# Altium schematic sheet 31 Pwr In.SchDoc
size 420 x 297 mm
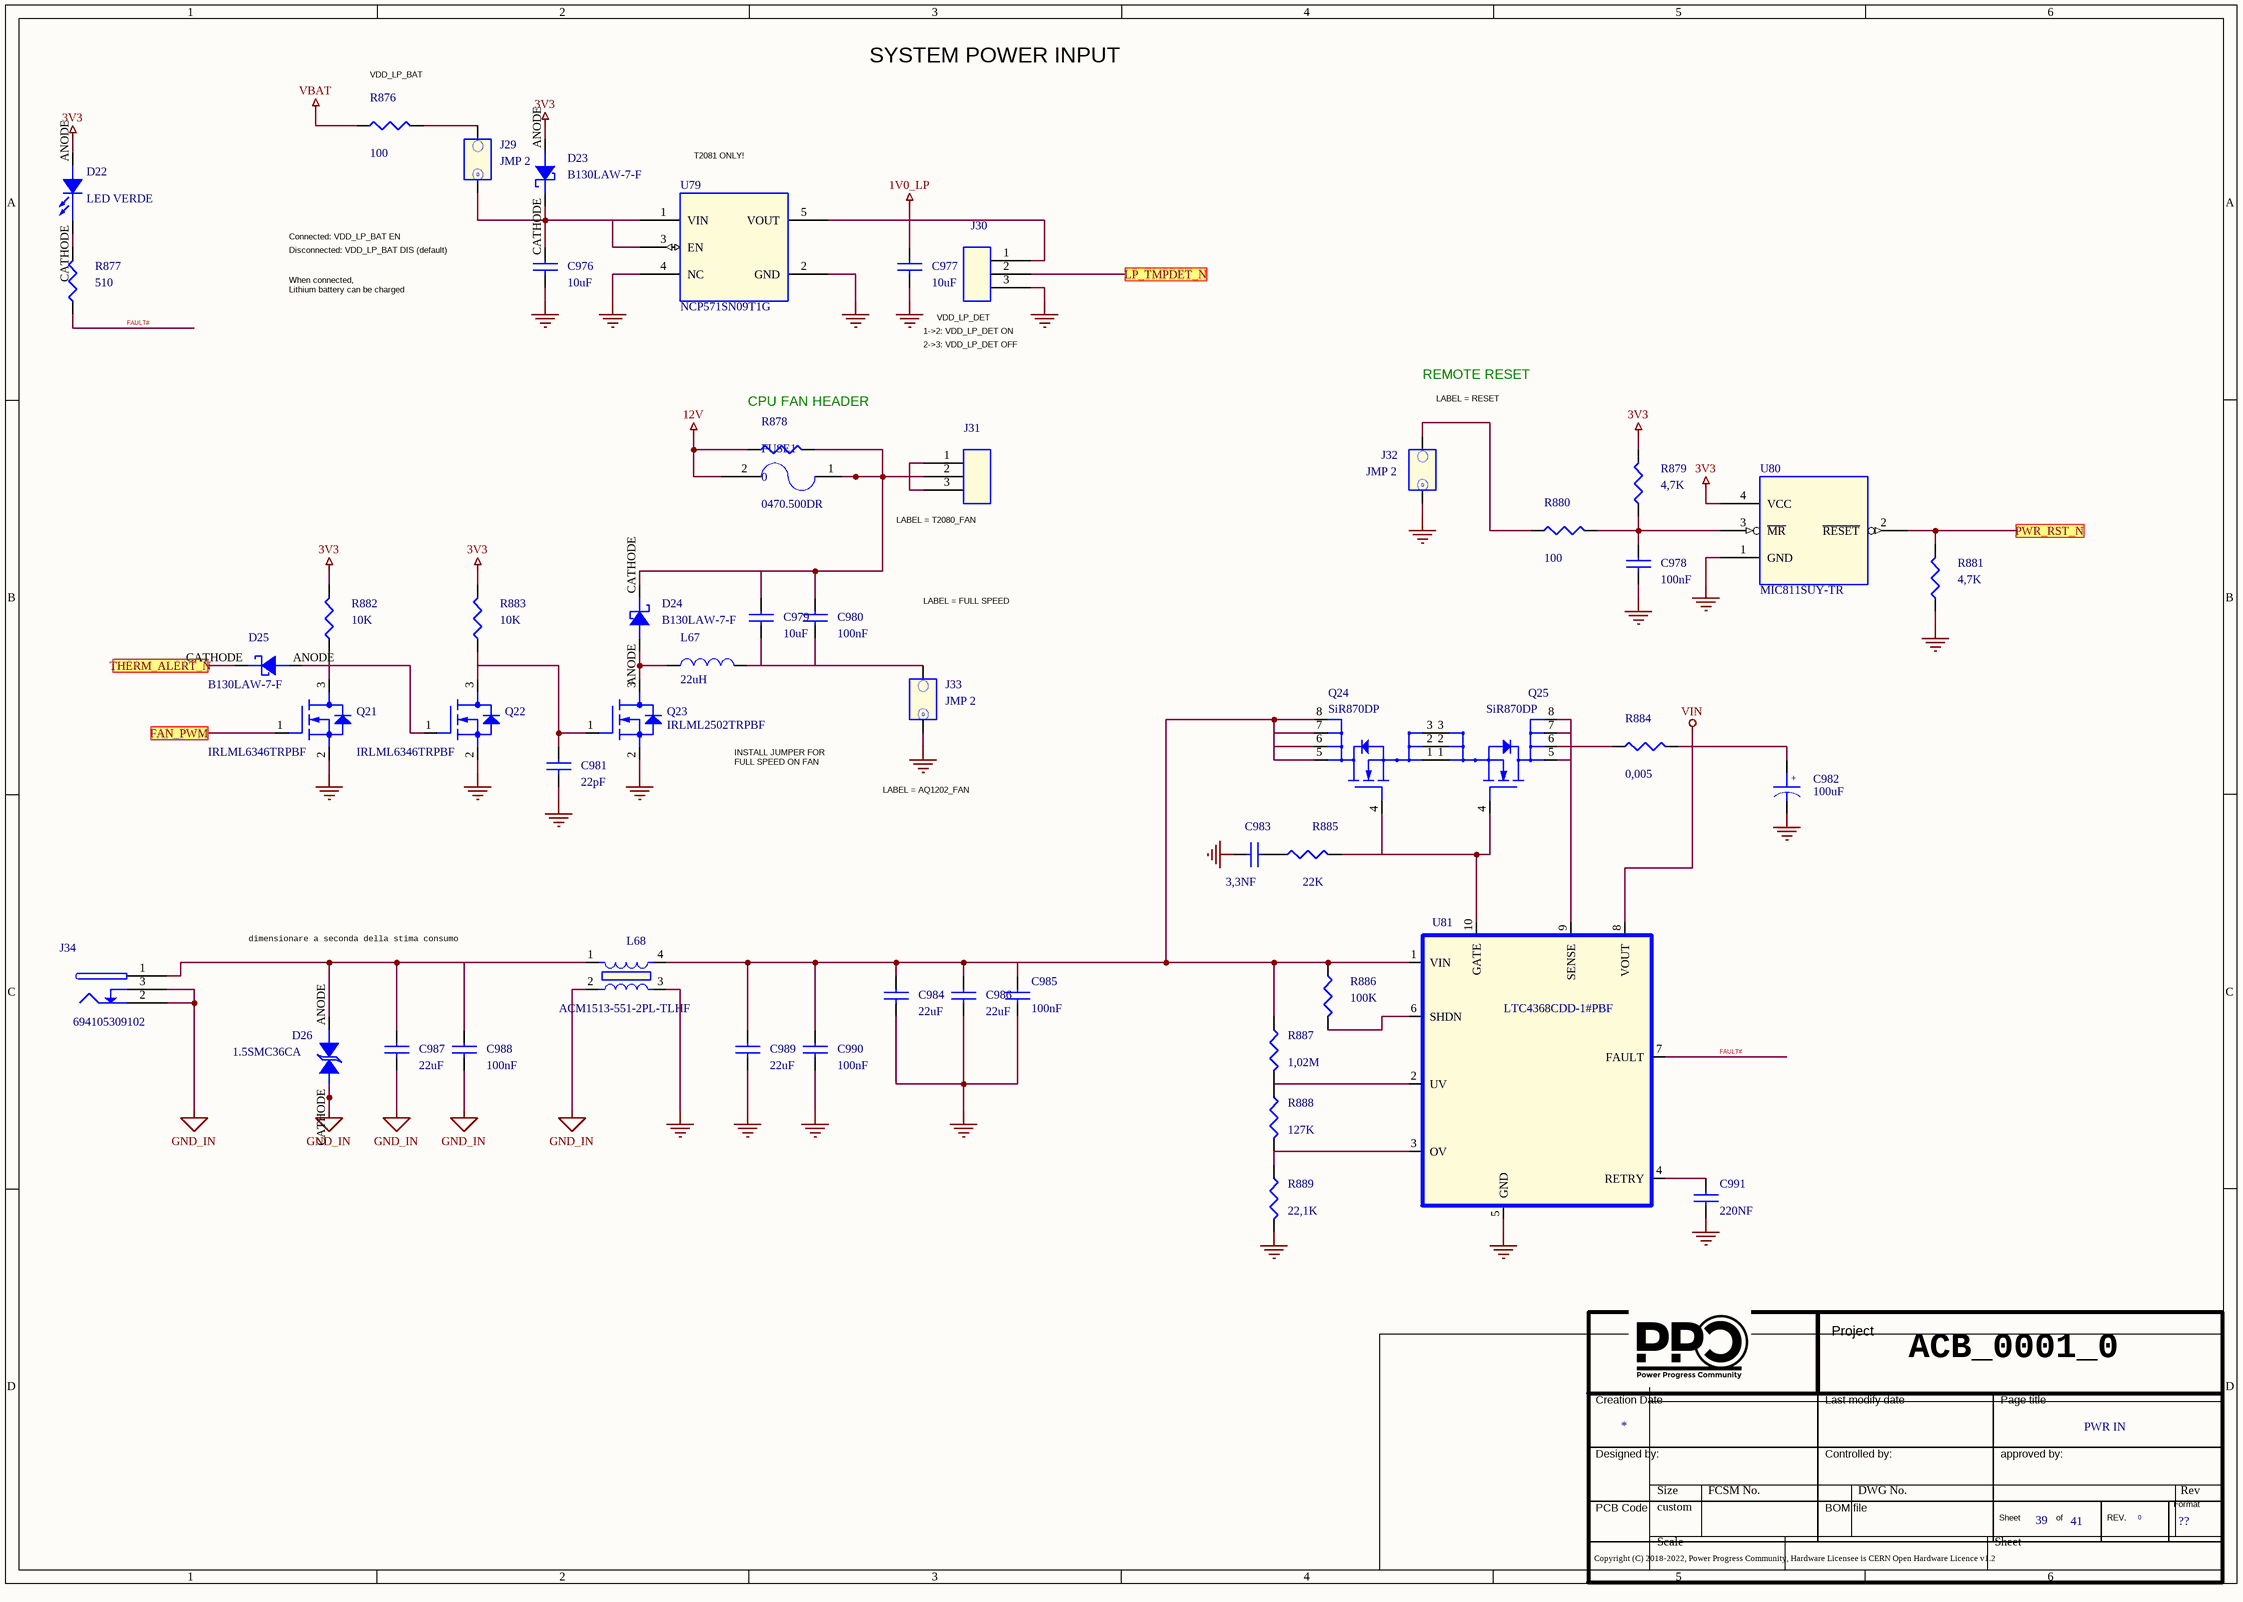
[diagram p0: 31 Pwr In.SchDoc]

## Parts
*  Doc: PWR IN  Page Count: 41  Page Number: 39  Page Size: ??  RevCode: 0  (hidden comment: Title_block_PPC)  (graphical)
C976  10uF  [SMD_0603]
C977  10uF  [SMD_0603]
C978  100nF  [SMD_0402]
C979  10uF  [SMD_0603]
C980  100nF  [SMD_0402]
C981  22pF  [SMD_0402]
C982  100uF  [SMD_8.3X8.3]
C983  3,3NF  [SMD_0402]
C984  22uF  [SMD_0805]
C985  100nF  [SMD_0603]
C986  22uF  [SMD_0805]
C987  22uF  [SMD_0805]
C988  100nF  [SMD_0603]
C989  22uF  [SMD_0805]
C990  100nF  [SMD_0603]
C991  220NF  [SMD_0402]
D22  LED VERDE  [led_0603]
D23  B130LAW-7-F  [SOD-123]
D24  B130LAW-7-F  [SOD-123]
D25  B130LAW-7-F  [SOD-123]
D26  1.5SMC36CA  [SMC]
FUSE1  0470.500DR  [SMD]
J29  JMP 2  [PTH]
J30  B3B-XH-A (LF)(SN)  [3_PIN_PASSO_2.5mm]  (value not drawn)
J31  B3B-XH-A (LF)(SN)  [3_PIN_PASSO_2.5mm]  (value not drawn)
J32  JMP 2  [PTH]
J33  JMP 2  [PTH]
J34  694105309102  [JACK_PTH]
L67  22uH  [SMD_DR73]
L68  ACM1513-551-2PL-TLHF  [SMD]
Q21  IRLML6346TRPBF  [sot23]
Q22  IRLML6346TRPBF  [sot23]
Q23  IRLML2502TRPBF  [sot23]
Q24  SiR870DP  [SSOT-6]
Q25  SiR870DP  [SSOT-6]
R876  100  [SMD_0402]
R877  510  [SMD_0402]
R878  0  [SMD_1206]
R879  4,7K  [SMD_0402]
R880  100  [SMD_0402]
R881  4,7K  [SMD_0402]
R882  10K  [SMD_0402]
R883  10K  [SMD_0402]
R884  0,005  [SMD_2512]
R885  22K  [SMD_0402]
R886  100K  [SMD_0402]
R887  1,02M  [SMD_0402]
R888  127K  [SMD_0402]
R889  22,1K  [SMD_0402]
U79  NCP571SN09T1G  [SOT-223]
U80  MIC811SUY-TR  [SOT143]
U81  LTC4368CDD-1#PBF  [DFN-10PIN-3X3]

## Ports
FAN_PWM, LP_TMPDET_N, PWR_RST_N, THERM_ALERT_N

## Nets
1V0_LP: C977.1 J30.1 U79.5(VOUT)
3V3: D22.ANODE D23.ANODE R879.2 R882.2 R883.2 U80.4(VCC)
12V: FUSE1.2 R878.1
GND: C976.2 C977.2 C978.2 C981.2 C982.2 C983.2 C984.2 C985.2 C986.2 C989.2 C990.2 C991.2 J30.3 J32.1 J33.1 L68.3 Q21.2(S) Q22.2(S) Q23.2(S) R881.1 R889.2 U79.2(GND) U79.4(NC) U80.1(GND) U81.5(GND)
GND_IN: C987.2 C988.2 D26.CATHODE J34.2 J34.3 L68.2
VBAT: R876.1
VIN: C982.1 R884.2 U81.8(VOUT)
FAN_PWM: Q21.1(G) ; port FAN_PWM
FAULT#: R877.1 U81.7(FAULT)
LP_TMPDET_N: J30.2 ; port LP_TMPDET_N
PWR_RST_N: R881.2 U80.2(~{RESET}) ; port PWR_RST_N
THERM_ALERT_N: D25.CATHODE ; port THERM_ALERT_N
NetC976_1: C976.1 D23.CATHODE J29.1 U79.1(VIN) U79.3(EN)
NetC978_1: C978.1 R879.1 R880.2 U80.3(~{MR})
NetC979_1: C979.1 C980.1 D24.CATHODE FUSE1.1 J31.2 R878.2
NetC979_2: C979.2 C980.2 J33.2 L67.2
NetC981_1: C981.1 Q22.3(D) Q23.1(G) R883.1
NetC983_1: C983.1 R885.2
NetC984_1: C984.1 C985.1 C986.1 C989.1 C990.1 L68.4 Q24.5(D1) Q24.6 Q24.7 Q24.8 R886.1 R887.1 U81.1(VIN)
NetC987_1: C987.1 C988.1 D26.ANODE J34.1 L68.1
NetC991_1: C991.1 U81.4(RETRY)
NetD22_CATHODE: D22.CATHODE R877.2
NetD24_ANODE: D24.ANODE L67.1 Q23.3(D)
NetD25_ANODE: D25.ANODE Q21.3(D) Q22.1(G) R882.1
NetJ29_2: J29.2 R876.2
NetJ31_1: J31.1 J31.3
NetJ32_2: J32.2 R880.1
NetQ24_1: Q24.1(S1) Q25.1(S1)
NetQ24_2: Q24.2(S2) Q25.2(S2)
NetQ24_3: Q24.3(S3) Q25.3(S3)
NetQ24_4: Q24.4(G) Q25.4(G) R885.1 U81.10(GATE)
NetQ25_5: Q25.5(D1) Q25.6 Q25.7 Q25.8 R884.1 U81.9(SENSE)
NetR886_2: R886.2 U81.6(SHDN)
NetR887_2: R887.2 R888.1 U81.2(UV)
NetR888_2: R888.2 R889.1 U81.3(OV)

## Notes on the sheet
- (near R876) VDD_LP_BAT
- SYSTEM POWER INPUT
- T2081 ONLY!
- Connected: VDD_LP_BAT EN
- Disconnected: VDD_LP_BAT DIS (default)
- When connected,
  Lithium battery can be charged
- (near J30) VDD_LP_DET
- 2->3: VDD_LP_DET OFF
- 1->2: VDD_LP_DET ON
- REMOTE RESET
- (near R878) CPU FAN HEADER
- (near J32) LABEL = RESET
- (near J31) LABEL = T2080_FAN
- LABEL = FULL SPEED
- INSTALL JUMPER FOR
  FULL SPEED ON FAN
- LABEL = AQ1202_FAN
- dimensionare a seconda della stima consumo
- ACB_0001_0
- (in symbol CAP POL_Dup2) +
- (in symbol Title_block_PPC) Project; Creation Date; Last modify date; Page title; Designed by:; Controlled by:; approved by:; Format; PCB Code; BOM file; Sheet; of; REV.; Copyright (C) 2018-2022, Power Progress Community, Hardware Licensee is CERN Open Hardware Licence v1.2

## Library data of the parts
* = Title_block_PPC: Title: T2080PCIe; Author: MICETEK; Page Create Date: March  8, 1995; Page Title: ?; Page Modify Date: *
C976 C977 C979 = CAP NP_Dup3: COND.CER.10uF 0603 25V SMD; Manufacturer Part Number 1: CL10A106MA8NRNC; Manufacturer 1: SAMSUNG; Part Number: PASSIVE_124; RSM: RC0603; PCB Footprint: SMD_0603; Part Type: Capacitors\Ceramic\SMD\0603
C978 C980 = CAP NP_Dup3: COND.CER. 100NF 50V 0402 X7R SMD; Part Number: PASSIVE_24; Manufacturer 1: TDK; Manufacturer Part Number 1: CGA2B3X7R1H104M050BD; RSM: RC0402; Part Type: Capacitors\Ceramic\SMD\0402; PCB Footprint: SMD_0402
C981 = CAP NP_Dup3: COND.CER. 22PF 50V 0402 NPO 5% SMD; Part Number: PASSIVE_65; Manufacturer 1: Murata; Manufacturer Part Number 1: GRM1555C1H220JZ01; RSM: RC0402; Part Type: Capacitors\Ceramic\SMD\0402; PCB Footprint: SMD_0402
C982 = CAP POL_Dup2: CAP ALUM 100UF 35V 20% SMD; Manufacturer Part Number 1: EMVY350ADA101MHA0G; Manufacturer 1: United chemi-Con; Part Number: PASSIVE_307; RSM: CE-8X8_3; PCB Footprint: SMD_8.3X8.3; Distributor 1: DIGIKEY (565-2477-1-ND); Part Type: Capacitors\Aluminium\SMD
C983 = CAP NP_Dup10: COND.CER. 3,3NF 50V 0402 X7R SMD; Part Number: PASSIVE_69; RSM: RC0402; PCB Footprint: SMD_0402; Part Type: Capacitors\Ceramic\SMD\0402
C984 C986 C987 C989 = CAP NP_Dup3: 22UF 35V 20% 0805; Manufacturer Part Number 1: C2012X5R1V226M125AC; Manufacturer 1: TDK; Part Number: PASSIVE_224; RSM: RC0805; PCB Footprint: SMD_0805; Part Type: Capacitors\Ceramic\SMD\0805
C985 = CAP NP_Dup10: COND.CER.100NF 50V 0603 X7R SMD; Manufacturer Part Number 1: ECJ1VB1H104K; Manufacturer 1: PANASONIC; Part Number: PASSIVE_118; RSM: RC0603; PCB Footprint: SMD_0603; Distributor 1: CLAITRON LASI SILVESTAR S.R.L.; Part Type: Capacitors\Ceramic\SMD\0603
C988 = CAP NP_Dup10: COND.CER.100NF 50V 0603 X7R SMD; LNK_PART: C0603X90; Manufacturer Part Number 1: ECJ1VB1H104K; Manufacturer 1: PANASONIC; Part Number: PASSIVE_118; ID: C1361; TECNO77: C0603; RSM: RC0603; PCB Footprint: SMD_0603; Distributor 1: CLAITRON LASI SILVESTAR S.R.L.; Part Type: Capacitors\Ceramic\SMD\0603
C990 = CAP NP_Dup10: COND.CER.100NF 50V 0603 X7R SMD; LNK_PART: C0603X90; Manufacturer Part Number 1: ECJ1VB1H104K; Manufacturer 1: PANASONIC; Part Number: PASSIVE_118; ID: C1363; TECNO77: C0603; RSM: RC0603; PCB Footprint: SMD_0603; Distributor 1: CLAITRON LASI SILVESTAR S.R.L.; Part Type: Capacitors\Ceramic\SMD\0603
C991 = CAP NP_Dup10: COND.CER. 220NF 10V 0402 X5R SMD; Manufacturer Part Number 1: LMK105BJ224KV-F; Manufacturer 1: Taiyo Yuden; Part Number: PASSIVE_60; RSM: RC0402; PCB Footprint: SMD_0402; Distributor 1: DIGIKEY(587-1228-1-ND); Part Type: Capacitors\Ceramic\SMD\0402
D22 = LED_1: LED CHIPLED VERDE 40mcd 570nm; Part Number: DISCRETE_31; Manufacturer 1: DIALIGHT; Manufacturer Part Number 1: 598-8070-107F; PCB Footprint: SMD_0603; RSM: LED0603-AK; TYPE: LED; Part Type: Diodes\LED; Distributor 1: MOUSER(645-598-8070-107F)
D23-D25 = diode_schottky: DIODE SCHOTTKY 30V 1A SOD123; Manufacturer 1: DIODES; Part Number: DISCRETE_74; RSM: SOD123-AK; Distributor 1: DIGIKEY (B130LAW-FDICT-ND); Manufacturer Part Number 1: B130LAW-7-F; Part Type: Diodes\SCHOTTKY; PCB Footprint: SOD-123
D26 = BIDIR_TRANSIL_0: 1.5SMC36A VARISTORE BIDIREZION. 36V SMD; Part Number: DISCRETE_207; Manufacturer 1: LITTLEFUSE; RSM: SMC-AK; Part Type: Protections; Manufacturer Part Number 1: 1.5SMC36CA; Distributor 1: EBV ELEKTRONIK S.R.L.; PCB Footprint: SMC
FUSE1 = 0453008: Surface Mount Fuses SMD FA 0.5A; Manufacturer 1: LITTLEFUSE; Part Number: MISC_28; RSM: FUSE-SMF-430; PCB Footprint: SMD; Distributor 1: MOUSER(576-0470.500DR ); Manufacturer Part Number 1: 0470.500DR; Part Type: FUSE
J29 J32 J33 = JUMPER_2: STRIP MASC.1x2P P=2.54 H=7.62; Manufacturer Part Number 1: TLW-102-05-G-S; Manufacturer 1: Samtec; Part Number: CONNECTORS_445; RSM: PIN-100MLS-2; Distributor 1: FARNELL(1668488); Part Type: Strip\Terminal; PCB Footprint: PTH
J30 = HEADER_3: CONN WIRE TO BOARD HEADER. VERTICAL. 3WAY; Part Number: CONNECTORS_574; Manufacturer 1: JST; RSM: JST-B3B-XH-A1-3; Part Type: WIRE_TO_BOARD\P2.5; Manufacturer Part Number 1: B3B-XH-A (LF)(SN); Distributor 1: FARNELL (1516277); PCB Footprint: 3_PIN_PASSO_2.5mm
J31 = HEADER_3: CONN WIRE TO BOARD HEADER. VERTICAL. 3WAY; Manufacturer 1: JST; Part Number: CONNECTORS_574; RSM: JST-B3B-XH-A1-3; Distributor 1: FARNELL (1516277); Manufacturer Part Number 1: B3B-XH-A (LF)(SN); Part Type: WIRE_TO_BOARD\P2.5; PCB Footprint: 3_PIN_PASSO_2.5mm
J34 = PWR_JACK: CC WR-DC PwrJk CtrPnTHT Right Angled; Part Number: CONNECTORS_703; Manufacturer 1: WURTH; RSM: WE-JACK-694105309102; PCB Footprint: JACK_PTH; Part Type: POWER JACK; Manufacturer Part Number 1: 694105309102; Distributor 1: MOUSER(710-694105309102)
L67 = INDUCTOR_Dup1: INDUTTANZA 22uH 1,67A DR73-220 SMD; Manufacturer Part Number 1: DR73-220-R; Manufacturer 1: COILTRONICS; Part Number: PASSIVE_502; RSM: IND-COILTRONICS-DR73; Part Type: Inductors\SMD\DR73; PCB Footprint: SMD_DR73
L68 = CM_CHOKE: CHOKE COMM MODE 550 OHM 10A SMD; Manufacturer 1: TDK; Part Number: PASSIVE_356; RSM: IND-TDK-ACM1513; PCB Footprint: SMD; Distributor 1: DIGIKEY(445-9331-1-ND); Manufacturer Part Number 1: ACM1513-551-2PL-TLHF; Part Type: Inductors\SMD\CM Choke
Q21 Q22 = NMOS: MOSFET N-CH 30V 3.4A SOT23; Part Number: DISCRETE_323; Manufacturer 1: ON Semi; TYPE: MOS; Vendor: IR; PCB Footprint: SOT-23; MPN: IRLML6346TRPBF; Part Type: Mosfet\SOT23; Manufacturer Part Number 1: IRLML6346TRPBF; Distributor 1: DIGIKEY (IRLML6346TRPBFCT-ND); RSM: SOT-23
Q23 = NMOS: MOSFET N-CH 20V 4.2A SOT-23; Manufacturer 1: INFINEON; Part Number: DISCRETE_323; Vendor: IR; TYPE: MOS; Distributor 1: DIGIKEY (IRLML2502TRPBFCT-ND); Manufacturer Part Number 1: IRLML2502TRPBF; PCB Footprint: SOT-23; Part Type: Mosfet\SOT23; MPN: IRLML2502TRPBF; RSM: SOT-23
Q24 = MOS_N_SO8_1: MOSFET 100V 60A 20W 6mohm @ 4.5V; Manufacturer Part Number 1: SiR870DP-T1-GE3; Manufacturer 1: Vishay; Part Number: DISCRETE_281; RSM: QFN-8-POWERPAK; PCB Footprint: PowerPAK-1212-8; Distributor 1: DIGIKEY(SiR870DP-T1-GE3CT-ND); Part Type: Mosfet\POWER_PAK
Q25 = MOS_N_SO8_1: MOSFET 100V 60A 20W 6mohm @ 4.5V; Part Number: DISCRETE_281; Manufacturer 1: Vishay; Manufacturer Part Number 1: SiR870DP-T1-GE3; RSM: QFN-8-POWERPAK; PCB Footprint: PowerPAK-1212-8; Part Type: Mosfet\POWER_PAK; Distributor 1: DIGIKEY(SiR870DP-T1-GE3CT-ND)
R876 = R_Dup6: RESIS.CHIP 100R 5% 0402 SMD; Manufacturer 1: ROYAL OHM; Part Number: PASSIVE_812; RSM: RC0402; Manufacturer Part Number 1: RESIS.CHIP 100R 5% 0402 SMD; Part Type: Resistors\Fixed\SMD\0402\5%; PCB Footprint: SMD_0402
R877 = R_Dup6: RESIS.CHIP 510R 1% 0402 SMD; Manufacturer 1: ROYAL OHM; Part Number: PASSIVE_749; RSM: RC0402; Manufacturer Part Number 1: RESIS.CHIP 510R 1% 0402 SMD; Part Type: Resistors\Fixed\SMD\0402\1%; PCB Footprint: SMD_0402
R878 = R_Dup6: RESIS. 0R 1/4W 1206 SMD E96; Manufacturer Part Number 1: RC1206JR-070RL; Manufacturer 1: YAGEO; Part Number: PASSIVE_1266; RSM: RC1206; Part Type: Resistors\Fixed\SMD\1206\5%; PCB Footprint: SMD_1206
R879 R881 = R_Dup6: RESIS.CHIP 4,7K 5% 0402 SMD; Manufacturer 1: ROYAL OHM; Part Number: PASSIVE_861; RSM: RC0402; Manufacturer Part Number 1: RESIS.CHIP 4,7K 5% 0402 SMD; Part Type: Resistors\Fixed\SMD\0402\5%; PCB Footprint: SMD_0402
R880 = R_Dup6: RESIS.CHIP 100R 5% 0402 SMD; Part Number: PASSIVE_812; Manufacturer 1: ROYAL OHM; RSM: RC0402; Part Type: Resistors\Fixed\SMD\0402\5%; Manufacturer Part Number 1: RESIS.CHIP 100R 5% 0402 SMD; PCB Footprint: SMD_0402
R882 R883 = R_Dup6: RESIS.CHIP 10K 1% 0402 SMD; Part Number: PASSIVE_584; Manufacturer 1: ROYAL OHM; RSM: RC0402; Part Type: Resistors\Fixed\SMD\0402\1%; Manufacturer Part Number 1: RESIS.CHIP 10K 1% 0402 SMD; PCB Footprint: SMD_0402
R884 = R_Dup9: RES 0.005 OHM 2W 1% 2512 SMD; Manufacturer Part Number 1: PA2512FKF7W0R005E; Manufacturer 1: YAGEO; Part Number: PASSIVE_1376; RSM: RC2512; PCB Footprint: SMD_2512; Distributor 1: DIGIKEY (YAG2145CT-ND); Part Type: Resistors\Fixed\SMD\2512\1%
R885 = R_Dup9: RESIS.CHIP 22K 5% 0402 SMD; Manufacturer 1: ROYAL OHM; Part Number: PASSIVE_843; RSM: RC0402; PCB Footprint: SMD_0402; Distributor 1: CAMEL ELETTRONICA SRL  #; Manufacturer Part Number 1: RESIS.CHIP 22K 5% 0402 SMD; Part Type: Resistors\Fixed\SMD\0402\5%
R886 = R_Dup6: RESIS.CHIP 100K 5% 0402 SMD; Manufacturer 1: ROYAL OHM; Part Number: PASSIVE_813; RSM: RC0402; Manufacturer Part Number 1: RESIS.CHIP 100K 5% 0402 SMD; PCB Footprint: SMD_0402; Part Type: Resistors\Fixed\SMD\0402\5%
R887 = R_Dup9: RESIS.CHIP 1,02M 1% 0402 SMD; Manufacturer Part Number 1: CRCW04021M02FKED; Manufacturer 1: Vishay; Part Number: PASSIVE_568; RSM: RC0402; PCB Footprint: SMD_0402; Distributor 1: DIGIKEY (541-1.02MLCT-ND); Part Type: Resistors\Fixed\SMD\0402\1%
R888 = R_Dup9: RESIS.CHIP 127K 1% 0402 SMD; Manufacturer Part Number 1: ERJ-2RKF1273X; Manufacturer 1: PANASONIC; Part Number: PASSIVE_597; RSM: RC0402; PCB Footprint: SMD_0402; Distributor 1: DIGIKEY (P127KLCT-ND); Part Type: Resistors\Fixed\SMD\0402\1%
R889 = R_Dup9: RESIS.CHIP 22,1K 1% 0402 SMD; Manufacturer Part Number 1: RMC1/16SK2212FT; Manufacturer 1: KAMAYA; Part Number: PASSIVE_647; RSM: RC0402; PCB Footprint: SMD_0402; Distributor 1: MODULI ELETTRONICI E COMPONENTI spa; Part Type: Resistors\Fixed\SMD\0402\1%
U79 = NCP571: IC REG LINEAR 0.9V 150MA 5TSOP; Manufacturer 1: ON Semi; Part Number: LINEAR_333; MPN: NCP571SN10T1G; RSM: TSOP-5; Distributor 1: DIGIKEY (NCP571SN09T1GOSCT-ND); Manufacturer Part Number 1: NCP571SN09T1G; Part Type: Regulators\LDO; Vendor: ON Semi; TYPE: IC; PCB Footprint: SOT-223
U80 = MAX811S: MPU VOLTAGE MONITOR; Manufacturer 1: MICROCHIP; Part Number: LOGIC_362; PCB Footprint: SOT-143; Vendor: Micrel; Distributor 1: DIGIKEY(576-1325-6-ND); Manufacturer Part Number 1: MIC811SUY-TR; Part Type: SUPERVISORS; MPN: MIC811SUY; TYPE: IC; RSM: SOT-143
U81 = LTC4368_0: SURGE SUPPRESSIONE ADJ; Part Number: LINEAR_286; Manufacturer 1: LINEAR; PCB Footprint: 10DFN; RSM: DFN-10-3_0X3_0; Part Type: PROTECTION; Manufacturer Part Number 1: LTC4368CDD-1#PBF; Distributor 1: DIGIKEY(LTC4368CDD-1#PBF-ND)